# EAGLE design mini_button (EAGLE 8.6.3)
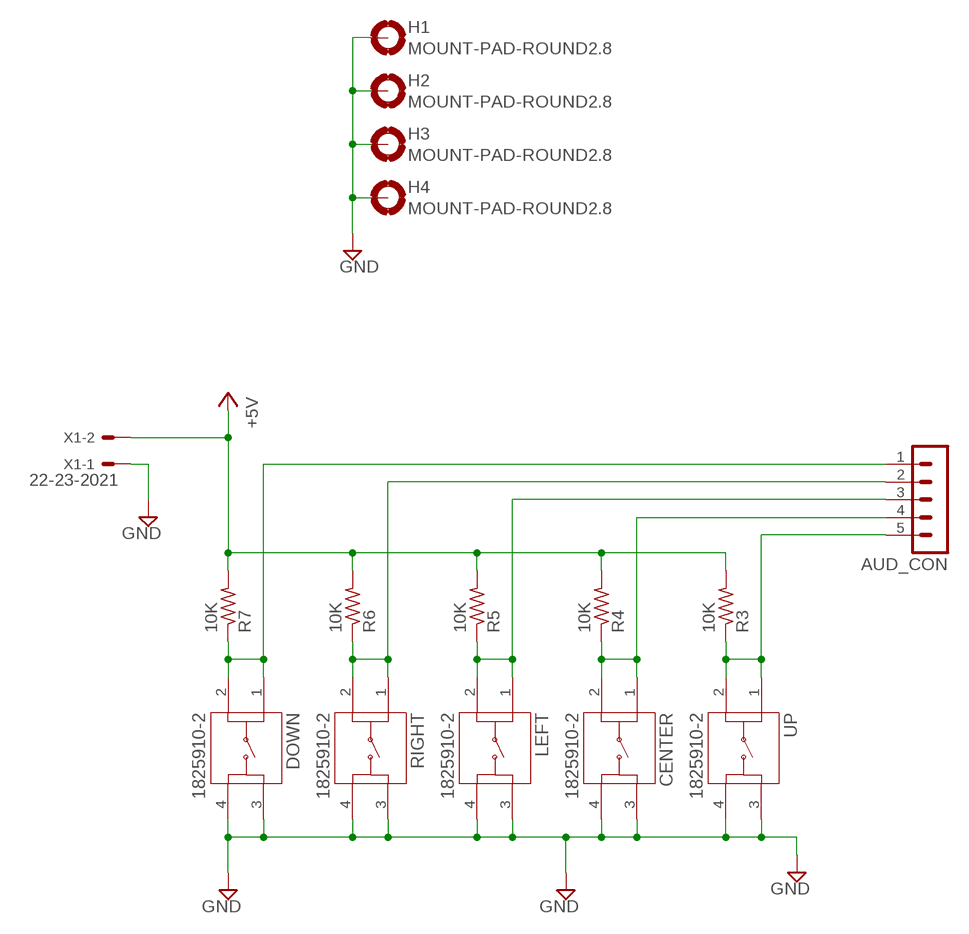
[diagram p0: schematic, sheet 1]

## Parts
AUD_CON  MA05-1  [MA05-1]
CENTER  1825910-2  [TE_1825910-2]
DOWN  1825910-2  [TE_1825910-2]
H1  MOUNT-PAD-ROUND2.8  [2,8-PAD]
H2  MOUNT-PAD-ROUND2.8  [2,8-PAD]
H3  MOUNT-PAD-ROUND2.8  [2,8-PAD]
H4  MOUNT-PAD-ROUND2.8  [2,8-PAD]
LEFT  1825910-2  [TE_1825910-2]
R3  10K  R-US_0204/7  [0204/7]
R4  10K  R-US_0204/7  [0204/7]
R5  10K  R-US_0204/7  [0204/7]
R6  10K  R-US_0204/7  [0204/7]
R7  10K  R-US_0204/7  [0204/7]
RIGHT  1825910-2  [TE_1825910-2]
UP  1825910-2  [TE_1825910-2]
X1  22-23-2021  [22-23-2021]

## Nets
+5V: R3.2 R4.2 R5.2 R6.2 R7.2 X1.2
CENTER: AUD_CON.4 CENTER.1 CENTER.2 R4.1
DOWN: AUD_CON.1 DOWN.1 DOWN.2 R7.1
GND: CENTER.3 CENTER.4 DOWN.3 DOWN.4 H1.B2,8(MOUNT) H2.B2,8(MOUNT) H3.B2,8(MOUNT) H4.B2,8(MOUNT) LEFT.3 LEFT.4 RIGHT.3 RIGHT.4 UP.3 UP.4 X1.1
LEFT: AUD_CON.3 LEFT.1 LEFT.2 R5.1
RIGHT: AUD_CON.2 R6.1 RIGHT.1 RIGHT.2
UP: AUD_CON.5 R3.1 UP.1 UP.2

## Library data of the parts
AUD_CON = con-lstb:MA05-1: PIN HEADER; OC_FARNELL: unknown; OC_NEWARK: unknown
CENTER DOWN LEFT RIGHT UP = SnapEDA Library:1825910-2: SWITCH TACTILE SPST-NO 0.05A 24V; MANUFACTURER: TE CONNECTIVITY; PARTREV: C10; STANDARD: manufacturer recommendation
H1-H4 = holes:MOUNT-PAD-ROUND: MOUNTING PAD, round
R3-R7 = rcl:R-US_: RESISTOR, American symbol; SPICEPREFIX: R
X1 = con-molex:22-23-2021: .100" (2.54mm) Center Header - 2 Pin; MF: MOLEX; MPN: 22-23-2021; OC_FARNELL: 1462926; OC_NEWARK: 25C3832

## Board
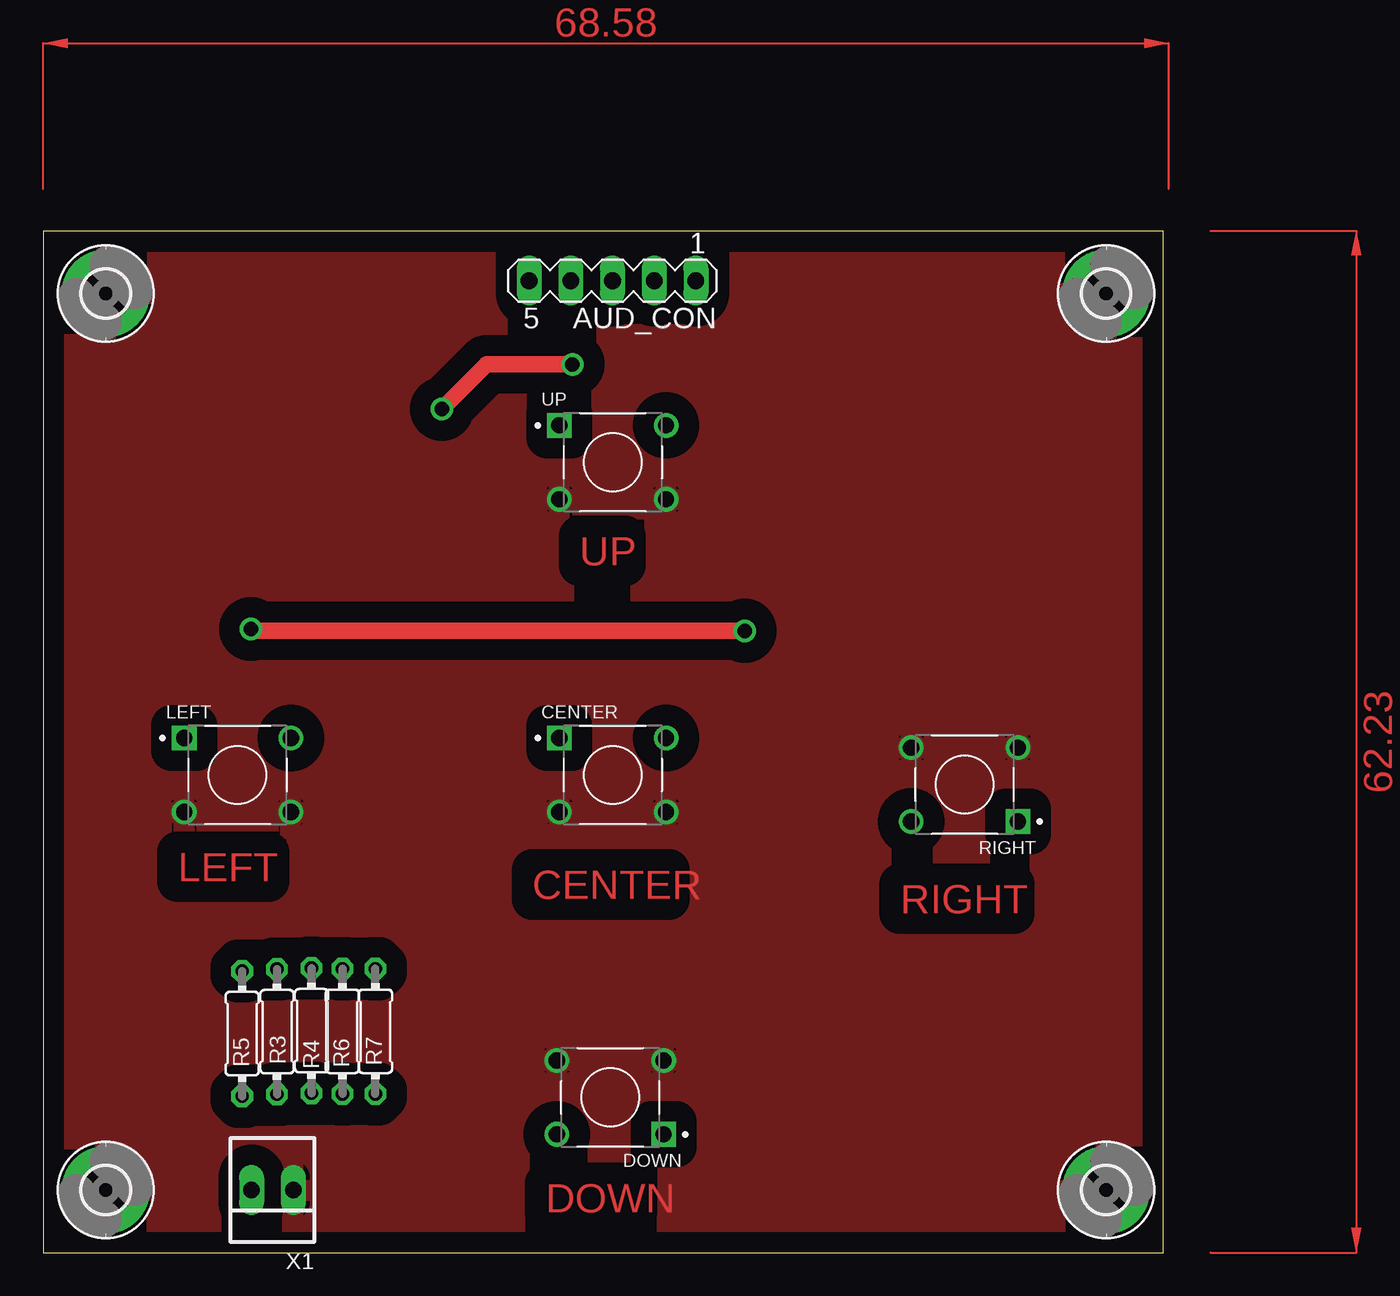
[diagram p1: board, top side]
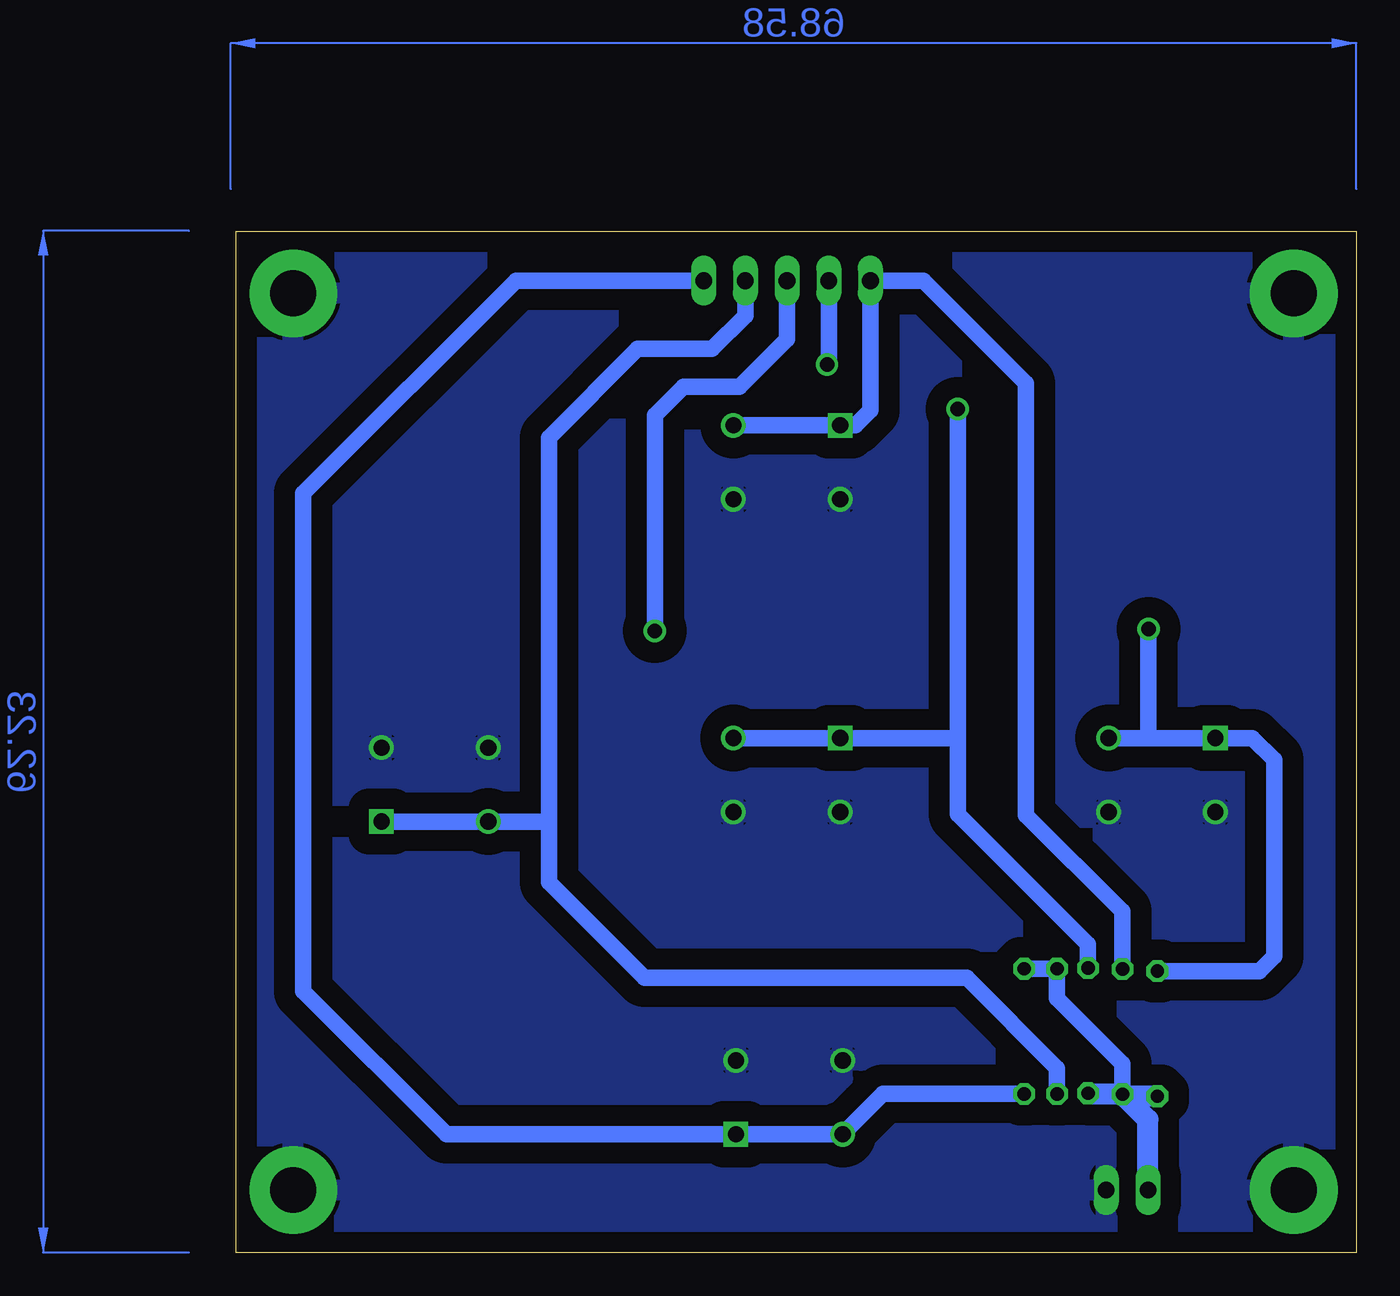
[diagram p2: board, bottom side, seen from below]

Size 68.25 x 62.22 mm. Coordinates in mm from the lower left corner, seen from the top.
Outline: 0,0 68.25,0 68.25,62.22 0,62.22 0,0
Copper layers (1*16): Top 0.035mm / dielectric 1.5mm / Bottom 0.035mm
Design rules "default": minimum track width 6mil, minimum drill 0.35mm, track to track 6mil, track to pad 6mil, pad to pad 6mil, via to via 6mil, smd to smd 6mil, copper to edge 40mil, drill to drill 6mil, minimum pad ring 10mil, minimum via ring 8mil, stop-mask expansion 4mil, vias tented up to drill 0mil, thermal gap 10mil

### Footprints (pad centres in the part's own frame; a part is rotated, then mirrored left to right if it is on the bottom)
MA05-1 = drill 1.016 long: 1 -5.08,0; 2 -2.54,0; 3 0,0; 4 2.54,0; 5 5.08,0
TE_1825910-2 = drill 0.99 square: 1 0,0 | drill 0.99: 2 6.5,0; 3 0,-4.5; 4 6.5,-4.5
2,8-PAD = drill 2.8 pad 5.334: B2,8 0,0
0204/7 = drill 0.813 octagon: 1 -3.81,0; 2 3.81,0
22-23-2021 = drill 1 long: 1 -1.27,0; 2 1.27,0

### Placement (x,y rotation side)
AUD_CON  34.69,59.19 180 top
CENTER  31.45,31.33 0 top
DOWN  37.8,7.2 180 top
H1  64.77,58.42 0 top
H2  64.77,3.81 0 top
H3  3.81,3.81 0 top
H4  3.81,58.42 0 top
LEFT  8.59,31.33 0 top
R3  14.25,13.45 270 top
R4  16.35,13.51 270 top
R5  12.12,13.33 270 top
R6  18.24,13.47 90 top
R7  20.24,13.47 90 top
RIGHT  59.39,26.25 180 top
UP  31.45,50.38 0 top
X1  13.97,3.81 180 top

### Tracks (layer width: path | path; a pad name or v marks a point on that pad's centre or on a via)
+5V
  Bottom 1.016: R3.2 14.25,11.51 18.24,15.5 R6.2 R7.2
  Bottom 1.27: R5.2 14.13,9.53 R3.2 | R3.2 16.29,9.64 R4.2 | X1.2 12.7,8.1 R3.2
CENTER  (via drill 0.9)
  Top 1.016: v32.25,54.09 27.01,54.09 v24.29,51.38
  Bottom 1.016: R4.1 16.35,18.77 24.29,26.71 24.29,31.21 | CENTER.2 CENTER.1 24.41,31.33 24.29,31.21 | 24.29,31.21 v24.29,51.38 | AUD_CON.4 32.15,54.19 v32.25,54.09
DOWN
  Bottom 1.016: R7.1 28.84,9.66 DOWN.2 DOWN.1 55.44,7.2 64.16,15.92 64.16,46.24 51.2,59.19 AUD_CON.1
GND
  pour Top (isolate 1.27): 0,62.23 68.58,62.23 68.58,1.27 68.58,0 19.05,0 0,0
  pour Bottom (isolate 1.27): 0,62.23 68.58,62.23 68.58,58.42 68.58,0 1.27,0 0,0
LEFT  (via drill 0.9)
  Top 1.016: v42.74,37.86 12.78,37.86 v12.66,37.98
  Bottom 1.016: LEFT.1 7.98,31.33 | LEFT.2 12.92,31.33 | 12.92,31.33 LEFT.1 | v12.66,37.98 12.66,31.59 12.92,31.33 | LEFT.1 6.33,31.33 5,30 5,18.06 5.91,17.15 R5.1 | v42.74,37.86 42.74,51 41,52.75 37.58,52.75 34.69,55.64 AUD_CON.3
RIGHT
  Bottom 1.016: R6.1 18.24,11.23 23.73,16.73 43.37,16.73 49.2,22.56 49.2,26.23 | 49.2,26.23 49.2,49.62 43.78,55.04 39.26,55.04 37.23,57.07 AUD_CON.2 | RIGHT.1 RIGHT.2 49.22,26.25 49.2,26.23
UP
  Bottom 1.016: R3.1 14.25,20.78 20.12,26.65 20.12,52.94 26.37,59.19 AUD_CON.5 29.61,51.3 30.52,50.38 UP.1 UP.2
(copper drawn outside any net)
  shapes: Bottom area x2, Top area x2

### Text on the board
Top: UP | LEFT | CENTER | RIGHT | DOWN